# EAGLE board ESP32_Display_2.1(K)_Main_V1.0 (EAGLE 9.6.2)
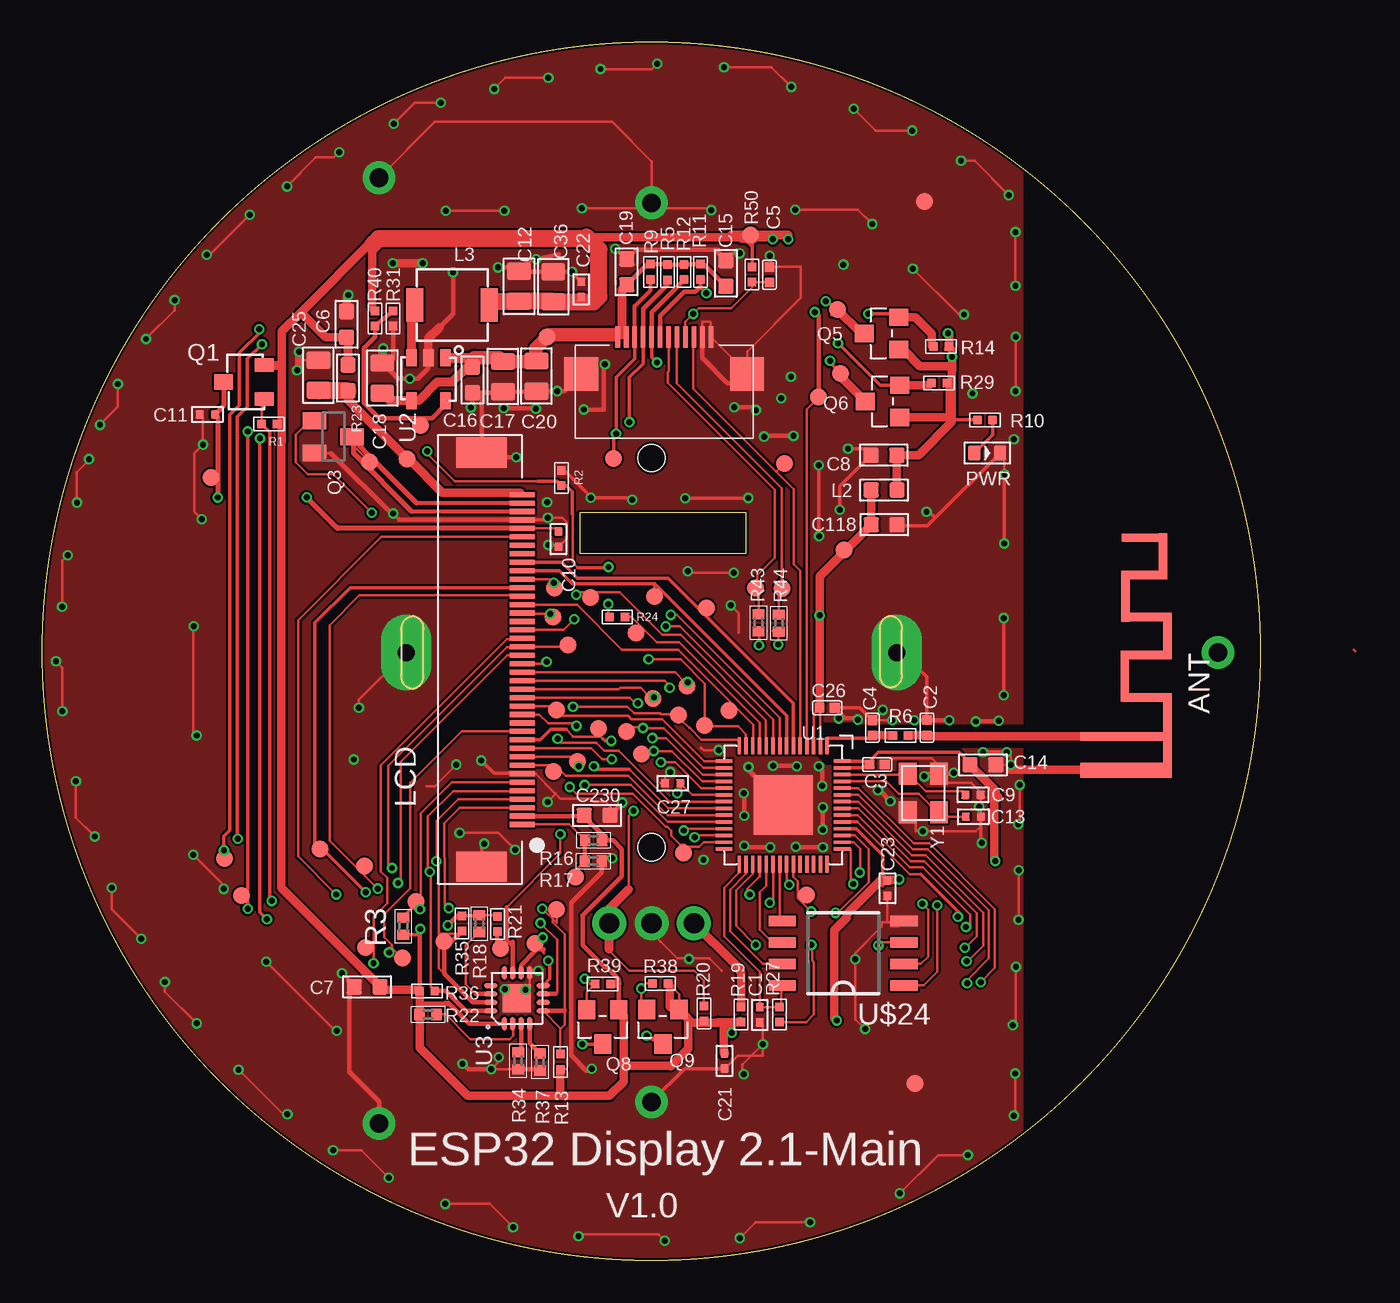
[diagram p6: board, top side]
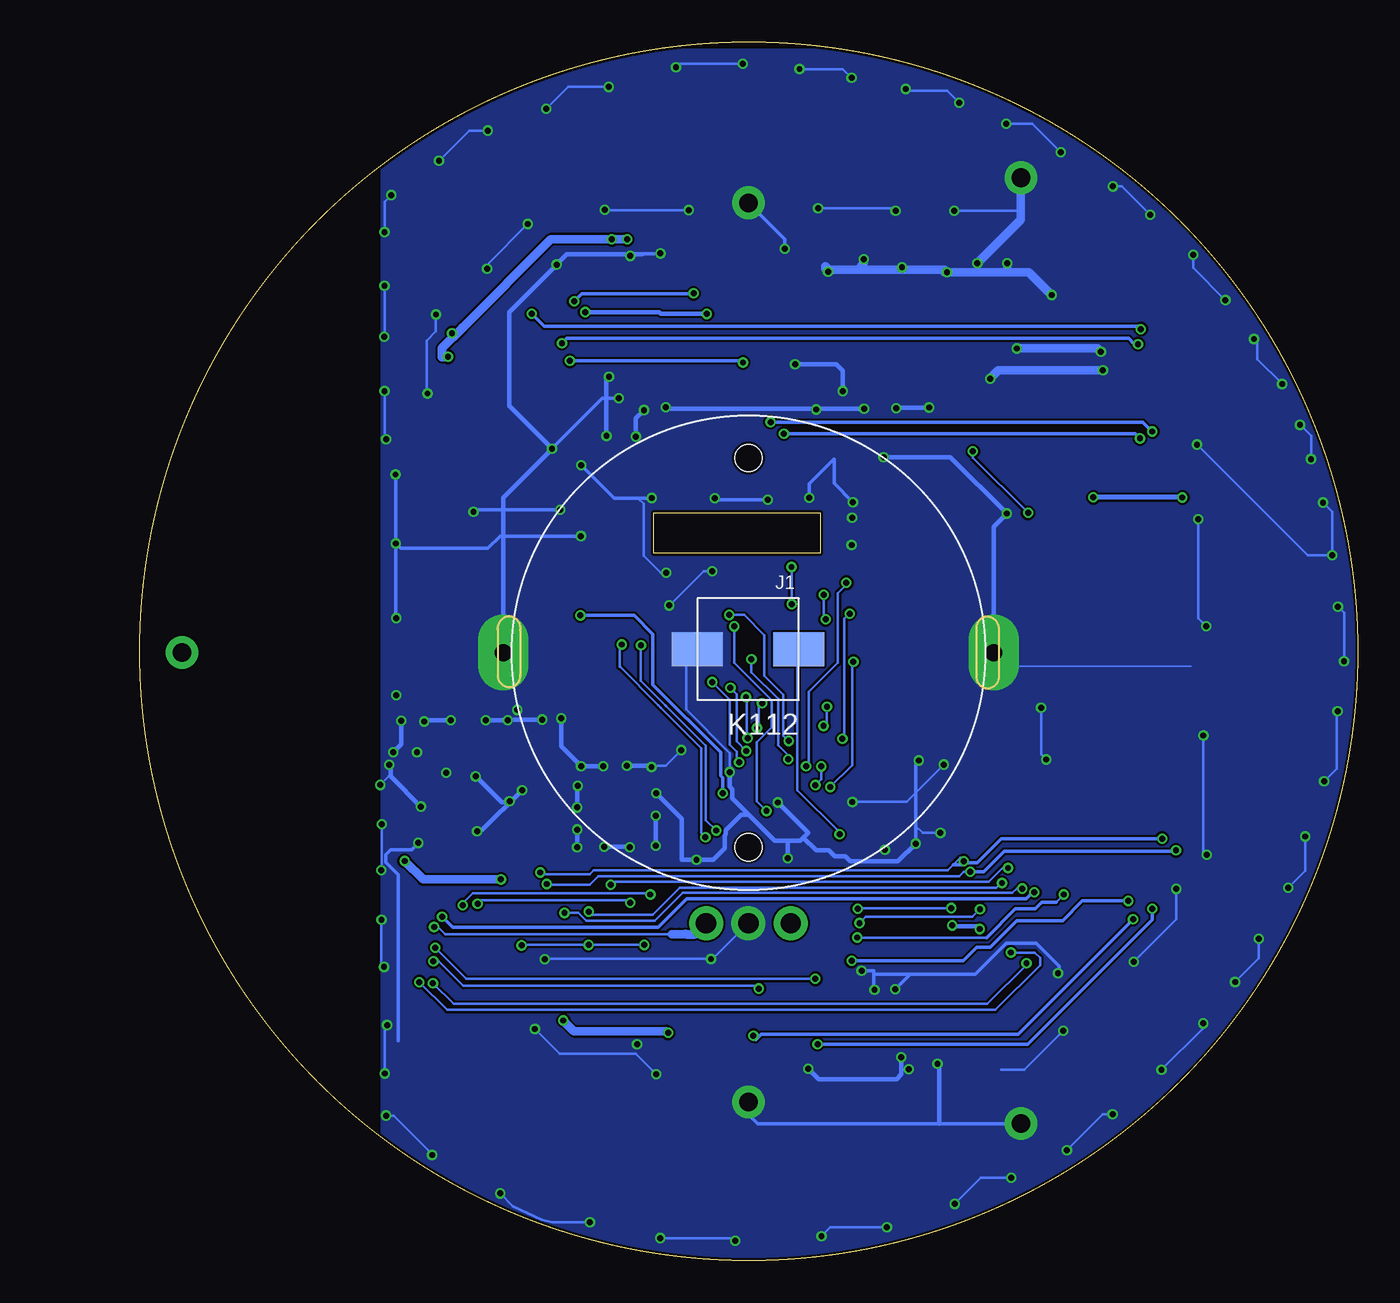
[diagram p7: board, bottom side, seen from below]

Size 72 x 72 mm. Coordinates in mm from the lower left corner, seen from the top.
Outline: 31.78,44.19 31.78,41.79 41.61,41.79 41.61,44.19 31.78,44.19
Outline: circle at 36,36 radius 36
Copper layers (1*16): Top 0.035mm / dielectric 1.5mm / Bottom 0.035mm
Design rules "default *": minimum track width 3mil, minimum drill 0.3mm, track to track 5mil, track to pad 5mil, pad to pad 5mil, via to via 5mil, smd to smd 5mil, copper to edge 6mil, drill to drill 6mil, minimum pad ring 5mil, minimum via ring 5mil, stop-mask expansion 4mil, vias tented up to drill 30mil, thermal gap 5mil
Net classes: 0 default: clearance 0.12 mm; 1 PWR: width 0.254 mm, clearance 0.12 mm to class 0, clearance 0.12 mm

## Footprints (pad centres in the part's own frame; a part is rotated, then mirrored left to right if it is on the bottom)
BT_ANT = smd 0.9 x 5.4: P$1 0,0 | smd 0.5 x 5.4: P$2 -2,0 | smd 5 x 0.5: P$3 -2.053,2.455 | smd 0.5 x 3: P$4 -4.305,1.198; P$6 -6.82,1.195 | smd 3 x 0.5: P$5 -5.57,-0.06; P$9 -10.285,-0.01 | smd 2.7 x 0.5: P$7 -7.93,2.465; P$11 -12.65,2.21 | smd 0.5 x 2.7: P$8 -9.045,1.37; P$10 -11.53,1.095; P$12 -13.74,1.105
0402 = smd 0.5 x 0.5: 1 -0.45,0; 2 0.45,0
C0402 = smd 0.6 x 0.6: 1 -0.45,0; 2 0.45,0
0603 = smd 0.889 x 0.889: 1 -0.762,0; 2 0.762,0
C0603 = smd 0.889 x 0.889: 1 -0.762,0; 2 0.762,0
0805 = smd 1.016 x 1.397: 1 -0.889,0; 2 0.889,0
EC28A-C15H15P3 = drill 1.2 pad 2: 1 -2.5,-16; 2 0,-16; 3 2.5,-16 | drill 1 pad 3 long: 4 -14.5,0; 5 14.5,0 | hole 1.6: 0,-11.5; 0,11.5
0.5MM-12P = smd 0.27 x 1.27: 1 -2.54,3.81; 2 -2.04,3.81; 3 -1.54,3.81; 4 -1.04,3.81; 5 -0.54,3.81; 6 -0.04,3.81; 7 0.46,3.81; 8 0.96,3.81; 9 1.46,3.81; 10 1.96,3.81; 11 2.46,3.81; 12 2.96,3.81 | smd 2 x 2: 13 -4.7,1.61; 14 5.1,1.61
BUTTON_2P = smd 3 x 2: P$1 0,0; P$2 6,0
L0603 = smd 0.889 x 0.889: 1 -0.762,0; 2 0.762,0
L0420 = smd 2 x 1: 1 0,2.2; 2 0,-2.2
0.5MM-40P = smd 1.8 x 3: 41 -2.42,-0.67; 42 22.08,-0.67 | smd 0.3 x 1.5: Y1 0.08,1.73; Y2 0.58,1.73; Y3 1.08,1.73; Y4 1.58,1.73; Y5 2.08,1.73; Y6 2.58,1.73; Y7 3.08,1.73; Y8 3.58,1.73; Y9 4.08,1.73; Y10 4.58,1.73; Y11 5.08,1.73; Y12 5.58,1.73; Y13 6.08,1.73; Y14 6.58,1.73; Y15 7.08,1.73; Y16 7.58,1.73; Y17 8.08,1.73; Y18 8.58,1.73; Y19 9.08,1.73; Y20 9.58,1.73; Y21 10.08,1.73; Y22 10.58,1.73; Y23 11.08,1.73; Y24 11.58,1.73; Y25 12.08,1.73; Y26 12.58,1.73; Y27 13.08,1.73; Y28 13.58,1.73; Y29 14.08,1.73; Y30 14.58,1.73; Y31 15.08,1.73; Y32 15.58,1.73; Y33 16.08,1.73; Y34 16.58,1.73; Y35 17.08,1.73; Y36 17.58,1.73; Y37 18.08,1.73; Y38 18.58,1.73; Y39 19.08,1.73; Y40 19.58,1.73
PAD-1.0MM = smd 1 x 1: P$1 0,0
LED-0603 = smd 0.762 x 0.889: + -0.762,0; - 0.762,0
SOT-23 = smd 1.1 x 0.8: 1 1.2,-1; 2 1.2,1 | smd 1.1 x 0.9: 3 -1.2,0
SPARKFUN_SOT23 = smd 1 x 1.4: 1 -0.95,-1.1; 2 0.95,-1.1; 3 0,1.1
SOT23 = smd 1.016 x 1.143: 1 -0.95,-1.016; 2 0.95,-1.016; 3 0,1.016
0402' = smd 0.5 x 0.5: P$1 -0.45,0; P$2 0.45,0
R0402 = smd 0.6 x 0.7: 1 -0.5,0; 2 0.5,0
DISCRETE_R0603 = smd 0.889 x 0.889: 1 -0.762,0; 2 0.762,0
ESP-S3-QFN56(7×7MM) = smd 1 x 0.2: 1 -3.5,2.6; 2 -3.5,2.2; 3 -3.5,1.8; 4 -3.5,1.4; 5 -3.5,1; 6 -3.5,0.6; 7 -3.5,0.2; 8 -3.5,-0.2; 9 -3.5,-0.6; 10 -3.5,-1; 11 -3.5,-1.4; 12 -3.5,-1.8; 13 -3.5,-2.2; 14 -3.5,-2.6; 29 3.5,-2.6; 30 3.5,-2.2; 31 3.5,-1.8; 32 3.5,-1.4; 33 3.5,-1; 34 3.5,-0.6; 35 3.5,-0.2; 36 3.5,0.2; 37 3.5,0.6; 38 3.5,1; 39 3.5,1.4; 40 3.5,1.8; 41 3.5,2.2; 42 3.5,2.6 | smd 0.2 x 1: 15 -2.6,-3.5; 16 -2.2,-3.5; 17 -1.8,-3.5; 18 -1.4,-3.5; 19 -1,-3.5; 20 -0.6,-3.5; 21 -0.2,-3.5; 22 0.2,-3.5; 23 0.6,-3.5; 24 1,-3.5; 25 1.4,-3.5; 26 1.8,-3.5; 27 2.2,-3.5; 28 2.6,-3.5; 43 2.6,3.5; 44 2.2,3.5; 45 1.8,3.5; 46 1.4,3.5; 47 1,3.5; 48 0.6,3.5; 49 0.2,3.5; 50 -0.2,3.5; 51 -0.6,3.5; 52 -1,3.5; 53 -1.4,3.5; 54 -1.8,3.5; 55 -2.2,3.5; 56 -2.6,3.5 | smd 3.5 x 3.5: 57 0,0
SOT23-5 = smd 1 x 0.635: 1 -1.27,1; 2 -1.27,0; 3 -1.27,-1; 4 1.27,-1; 5 1.27,1
QFN16-3*3 = smd 0.8 x 0.3: 1 -1.5,0.75; 2 -1.5,0.25; 3 -1.5,-0.25; 4 -1.5,-0.75; 9 1.5,-0.75; 10 1.5,-0.25; 11 1.5,0.25; 12 1.5,0.75 | smd 0.3 x 0.8: 5 -0.75,-1.55; 6 -0.25,-1.55; 7 0.25,-1.55; 8 0.75,-1.55; 13 0.75,1.55; 14 0.25,1.55; 15 -0.25,1.55; 16 -0.75,1.55 | smd 1.65 x 1.65: 17 0,0
T-2-1.1 = drill 1.1 pad 1.93: P$1 0,0
FLASHSOP8_SOP8 = smd 0.6 x 1.6: 1 -1.905,-3.6; 2 -0.635,-3.6; 3 0.635,-3.6; 4 1.905,-3.6; 5 1.905,3.6; 6 0.635,3.6; 7 -0.635,3.6; 8 -1.905,3.6
CRYSTAL-3.2-2.5 = smd 1.3 x 1.05: 1 -1.15,-0.925; 2 1.15,-0.925; 3 1.15,0.925; 4 -1.15,0.925

## Placement (x,y rotation side)
ANT  BT_ANT  [BT_ANT]  64.05,28.97 270 top
C1  1UF  [0402]  42.41,14.51 270 top
C2  NC  [C0402]  52.3,31.48 270 top
C3  1uF  [C0402]  49.35,29.3 180 top
C4  NC  [C0402]  49.07,31.47 270 top
C5  1uF  [C0402]  42.99,58.26 270 top
C6  100NF  [0603]  17.99,55.33 90 top
C7  1uF  [C0603]  19.2,16.16 180 top
C8  10NF  [C0603]  49.75,47.59 180 top
C9  12pF  [0402]  55.02,27.51 0 top
C10  1UF  [0402]  30.52,42.63 270 top
C11  100nF  [0402]  9.76,50 180 top
C12  22uF  [0805]  28.18,57.57 270 top
C13  12pF  [0402]  55.04,26.22 0 top
C14  100NF  [C0603]  55.61,29.29 0 top
C15  100NF  [0603]  40.41,58.34 90 top
C16  100NF  [0603]  25.43,52.04 270 top
C17  22uF  [0805]  27.23,52.24 90 top
C18  22uF  [0805]  20.1,52.15 270 top
C19  100NF  [0603]  34.55,58.43 90 top
C20  22uF  [0805]  29.21,52.27 90 top
C21  1UF  [0402]  40.33,11.78 270 top
C22  100nF  [0402]  31.86,57.39 90 top
C23  100nF  [0402]  49.96,21.99 270 top
C25  1uF\30V  [0805]  16.32,52.32 270 top
C26  1uF  [C0402]  46.4,32.66 0 top
C27  0.1uF  [0402]  37.27,28.2 0 top
C36  22uF  [0805]  30.21,57.55 270 top
C118  NC/3PF  [0603]  49.77,43.48 180 top
C230  100nF  [C0603]  32.8,26.3 180 top
J1  EC28A-C15H15P3  [EC28A-C15H15P3]  36.02,35.92 0 bottom
J10  CON_12P_0.5  [0.5MM-12P]  36.56,50.78 0 top
K112  BUTTON_2P  [BUTTON_2P]  33.04,36.12 180 bottom
L2  100M-600R  [L0603]  49.76,45.53 180 top
L3  2.2UH  [L0420]  24.23,56.47 90 top
LCD  LCD-2.1-40P-0.5  [0.5MM-40P]  26.64,45.34 270 top
P1  [PAD-1.0MM]  37.92,24.06 0 top
P2  [PAD-1.0MM]  19.06,23.31 0 top
P3  [PAD-1.0MM]  40.59,32.49 0 top
P4  [PAD-1.0MM]  21.55,47.37 0 top
P5  [PAD-1.0MM]  19.34,47.2 0 top
P6  [PAD-1.0MM]  41.87,60.61 0 top
P7  [PAD-1.0MM]  29.12,18.71 0 top
P8  [PAD-1.0MM]  39.27,38.56 0 top
P9  [PAD-1.0MM]  36.18,39.25 0 top
P10  [PAD-1.0MM]  30.29,39.75 0 top
P11  [PAD-1.0MM]  16.43,24.3 0 top
P12  [PAD-1.0MM]  30.2,38.03 0 top
P13  [PAD-1.0MM]  32.4,39.17 0 top
P14  [PAD-1.0MM]  19.1,18.5 0 top
P15  [PAD-1.0MM]  31.07,36.38 0 top
P16  [PAD-1.0MM]  45.19,21.6 0 top
P17  [PAD-1.0MM]  32.89,31.42 0 top
P18  [PAD-1.0MM]  35.43,29.94 0 top
P19  [PAD-1.0MM]  38.12,33.94 0 top
P20  [PAD-1.0MM]  36.11,33.2 0 top
P21  [PAD-1.0MM]  34.55,31.25 0 top
P22  [PAD-1.0MM]  30.39,32.52 0 top
P23  [PAD-1.0MM]  37.61,32.23 0 top
P24  [PAD-1.0MM]  21.28,17.86 0 top
P25  [PAD-1.0MM]  22.09,21.22 0 top
P26  [PAD-1.0MM]  39.16,31.6 0 top
P27  [PAD-1.0MM]  31.65,29.49 0 top
P28  [PAD-1.0MM]  30.22,28.89 0 top
P29  [PAD-1.0MM]  31.53,22.66 0 top
P30  [PAD-1.0MM]  10.77,23.74 0 top
P31  [PAD-1.0MM]  23.75,18.85 0 top
P32  [PAD-1.0MM]  30.4,20.74 0 top
P33  [PAD-1.0MM]  33.78,47.39 0 top
P34  [PAD-1.0MM]  9.96,46.26 0 top
P35  [PAD-1.0MM]  52.16,62.6 0 top
P36  [PAD-1.0MM]  51.6,10.46 0 top
P37  [PAD-1.0MM]  42.15,39.74 0 top
P38  [PAD-1.0MM]  11.77,21.56 0 top
P39  [PAD-1.0MM]  47.2,52.42 0 top
P40  [PAD-1.0MM]  47,56.2 0 top
P41  [PAD-1.0MM]  27.1,18.43 0 top
P42  [PAD-1.0MM]  43.72,39.7 0 top
P43  [PAD-1.0MM]  45.9,51.02 0 top
P44  [PAD-1.0MM]  43.87,47.11 0 top
P45  [PAD-1.0MM]  47.4,42 0 top
P46  [PAD-1.0MM]  29.83,54.57 0 top
P47  [PAD-1.0MM]  22.37,49.34 0 top
P48  [PAD-1.0MM]  35.1,37.07 0 top
PWR  Green  [LED-0603]  55.86,47.72 0 top
Q1  PMOS-3401-4A  [SOT-23]  11.92,51.92 0 top
Q3  S8050  [SPARKFUN_SOT23]  17.2,48.67 270 top
Q5  BSN20  [SOT23]  49.61,54.79 90 top
Q6  BSN20  [SOT23]  49.67,50.77 90 top
Q8  BSN20  [SOT23]  33.13,13.79 180 top
Q9  BSN20  [SOT23]  36.69,13.8 180 top
R1  10K  [0402']  13.41,49.43 0 top
R2  1K  [0402']  30.68,46.24 270 top
R3  4.7K  [R0402]  21.34,19.75 270 top
R5  10k  [0402']  36.95,58.41 90 top
R6  0R  [0402']  50.73,31.03 180 top
R9  10k  [0402']  35.96,58.43 90 top
R10  1K  [0402']  55.73,49.68 180 top
R11  10k  [0402']  38.92,58.43 90 top
R12  10k  [0402']  37.94,58.42 90 top
R13  10K  [0402']  30.63,11.73 90 top
R14  10K  [0402']  53.14,54.01 180 top
R16  10K  [R0402]  32.59,24.83 0 top
R17  NC  [R0402]  32.57,23.59 0 top
R18  4.7K  [R0402]  25.83,19.9 270 top
R19  10K  [0402']  41.31,14.53 270 top
R20  10K  [0402']  39.11,14.58 270 top
R21  10K  [0402']  26.9,19.88 90 top
R22  4.7K  [R0402]  22.8,14.53 180 top
R23  3.9R 1%  [DISCRETE_R0603]  18.07,52.16 270 top
R24  1K  [0402']  33.99,38.03 180 top
R27  10K  [0402']  43.59,14.52 270 top
R29  10K  [0402']  53.02,51.85 180 top
R31  24K  [0402']  20.74,55.67 90 top
R34  4.7K  [R0402]  28.13,11.79 270 top
R35  10k  [0402']  24.82,19.9 90 top
R36  10k  [0402']  22.75,15.92 0 top
R37  4.7K  [R0402]  29.42,11.72 270 top
R38  10k  [0402']  36.53,16.37 0 top
R39  10k  [0402']  33.13,16.33 180 top
R40  110K  [0402']  19.68,55.67 90 top
R43  10R  [R0402]  42.34,37.69 270 top
R44  10R  [R0402]  43.54,37.65 270 top
R50  10K  [0402']  41.96,58.27 270 top
U1  ESP-S3-QFN56(7×7MM)  [ESP-S3-QFN56(7×7MM)]  43.8,26.91 270 top
U2  RY3420  [SOT23-5]  22.83,52.09 270 top
U3  PCF8574RGT  [QFN16-3*3]  28.06,15.49 90 top
U$9  T-2-1.1  [T-2-1.1]  36.01,9.36 0 top
U$19  T-2-1.1  [T-2-1.1]  36.02,62.51 0 top
U$24  FLASHSOP8_W25X20CL  [FLASHSOP8_SOP8]  47.34,18.15 90 top
U$29  T-2-1.1  [T-2-1.1]  19.91,63.99 0 bottom
U$30  T-2-1.1  [T-2-1.1]  69.51,35.93 0 top
U$32  T-2-1.1  [T-2-1.1]  19.91,8.08 0 top
Y1  3225_40M  [CRYSTAL-3.2-2.5]  52.08,27.62 270 top

## Tracks (layer width: path | path; a pad name or v marks a point on that pad's centre or on a via)
3.3V  (via drill 0.35)
  Top 0.15: U1.20 38.41,27.51 C27.2 | C118.2 48.88,43.48 P45.P$1 47.21,41.81 45.95,40.55 v45.95,38.12 | U1.3 45.6,32.31 C26.1 46,32.61 U1.2
  Top 0.2: C27.2 37.72,27.76 37.54,27.58 v37.54,27.61
  Top 0.5: L2.2 C118.2 47.34,41.81 | 47.34,41.81 47.21,41.81 | C26.1 45.95,33.56 45.95,33.95 v45.95,38.12 45.95,40.42 47.34,41.81
  Bottom 0.2: v37.54,27.61 37.54,28.53 37.65,28.64 37.65,30.02 41.66,34.03 41.66,37.01 42.77,38.12 v45.95,38.12
11
  cutout Top: 58.52,65.15 73.05,61.17 69.08,65.14 58.53,65.14
33
  cutout Top: 45.93,31.6 46.18,31.35 46.18,30.34 59.45,30.34 59.45,31.62 45.93,31.62 45.93,30.41
555
  cutout Top: 45.82,31.65 45.81,31.64 45.81,29.82 46.31,29.32 46.32,29.31 48.13,29.31 48.13,31.56 47.96,31.73 45.95,31.73 45.82,31.6
8888
  cutout Top: 58.02,64.72 58.02,7.52 59.04,6.5 72.13,19.59 72.13,55.22 62.88,64.47 58.08,64.47 58.05,64.44 58.05,64.38
B1  (via drill 0.35)
  Top 0.15: U1.10 42.78,30.43 42.78,31.92 37.73,36.97 36.65,36.97 34.14,39.48 32.43,39.48 31.81,39.48 31.71,39.48 v31.57,39.34 | v31.45,37.89 30.82,37.26 LCD.Y17
  Top 0.152: 32.43,39.48 32.4,39.45 P13.P$1 32.09,39.48 31.81,39.48
  Bottom 0.15: v31.57,39.34 31.57,38.01 v31.45,37.89
B2  (via drill 0.35)
  Top 0.15: U1.51 48.25,27.51 51.46,24.3 52.35,24.3 55.96,20.69 55.96,17.84 54.67,16.55 v54.67,16.38 | v19.58,17.56 19.58,18.74 | 19.58,18.74 19.58,20.31 20.38,21.11 20.38,22.61 20.01,22.98 20.01,29.25 27.46,36.7 28.31,36.7 LCD.Y18 | P14.P$1 19.34,18.5 19.58,18.74
  Top 0.152: 19.16,18.44 P14.P$1 | U1.51 47.58,27.51
  Bottom 0.15: v54.67,16.38 53.44,15.15 21.89,15.15 19.54,17.5 19.54,17.52 v19.58,17.56
B3  (via drill 0.35)
  Top 0.15: U1.36 44,22.3 44.1,22.2 v44.16,22.2 | v20.68,23.19 20.46,23.41 20.46,29.24 27.47,36.25 LCD.Y19 30.95,36.26 P15.P$1
  Top 0.152: 31.34,36.38 P15.P$1
  Bottom 0.15: v44.16,22.2 43.99,22.37 21.82,22.37 20.84,23.35 v20.68,23.19
B4  (via drill 0.35)
  Top 0.15: U1.37 44.4,22.67 44.66,22.41 44.66,21.41 44.73,21.34 | 44.73,21.34 v45.46,20.61 | v21.03,22.3 v21.03,22.29 21.2,22.12 21.2,29.47 27.49,35.76 LCD.Y20 | P16.P$1 44.93,21.34 44.73,21.34
  Top 0.152: 45.36,21.77 P16.P$1
  Bottom 0.15: v45.46,20.61 45.28,20.43 41.67,20.43 40.07,22.03 21.37,22.03 21.11,22.3 21.07,22.26 v21.03,22.3
B5  (via drill 0.35)
  Top 0.15: 37.95,24.56 37.98,24.56 38.1,24.44 38.83,24.44 39.1,24.71 U1.27 | 37.95,24.56 37.71,24.56 37.19,25.08 37.19,25.39 36.95,25.63 36.86,25.63 34.91,27.58 31.58,27.58 v31.18,27.98 | v29.81,35.38 29.69,35.26 LCD.Y21 | P1.P$1 37.92,24.53 37.95,24.56
  Top 0.152: P1.P$1 37.92,24.39
  Bottom 0.15: v31.18,27.98 29.88,29.28 29.88,35.31 v29.81,35.38
BL_PWM
  Top 0.15: U1.11 42.4,31.76 37.64,36.52 36.33,36.52 35.49,37.36 | R24.P$1 34.82,38.03 35.49,37.36 | P48.P$1 35.39,37.36 35.49,37.36
DE  (via drill 0.35)
  Top 0.15: U1.45 48.02,25.11 48.84,24.29 48.84,22.35 46.96,20.47 46.95,20.47 v46.89,20.53 | LCD.Y13 28.33,39.3 18.74,39.3 16.99,37.55 16.99,24.81 v19.83,21.97 19.06,22.74 P2.P$1
  Bottom 0.15: v46.89,20.53 46.09,20.53 45.62,20.06 41.54,20.06 39.89,21.71 20.41,21.71 20.15,21.97 v19.83,21.97
ENCODER_SW  (via drill 0.35)
  Top 0.15: 27.81,18.86 U3.11 27.81,18.53 27.59,18.75 | 27.45,20.87 30.63,24.05 v30.63,25.18 | 27.8,18.84 27.51,18.84 P41.P$1
  Top 0.254: 27.45,20.87 27.45,18.78 P41.P$1 26.9,18.63 R21.P$1 | 27.8,18.84 U3.11
  Bottom 0.15: K112.P$1 33.12,36.04 33.12,27.79 30.63,25.3 v30.63,25.18
ESP_RXD  (via drill 0.35)
  Top 0.15: Q9.2 35.4,15.16 v35.4,16.06 35.71,16.37 R38.P$1 | U1.50 48.24,27.11 51.41,23.94 52.23,23.94 55.62,20.55 55.62,18.59 54.7,17.67 v54.64,17.67
  Bottom 0.15: v54.64,17.67 54.32,17.67 52.87,16.22 35.56,16.22 v35.4,16.06
ESP_TXD  (via drill 0.35)
  Top 0.15: Q8.2 32.18,15.83 R39.P$2 32.37,16.33 v32.06,16.64 | U1.49 48.22,26.71 51.34,23.6 52.14,23.6 55.24,20.5 55.24,19.17 54.55,18.48 v54.53,18.48
  Top 0.152: U1.49 47.33,26.71
  Bottom 0.15: v54.53,18.48 52.69,16.64 v32.06,16.64
G0  (via drill 0.35)
  Top 0.12: 28.39,34.78 LCD.Y22
  Top 0.15: U1.19 38.95,27.91 37.42,29.44 v36.57,29.44 | LCD.Y22 37.41,34.76 37.99,34.18 v38.16,34.18 38.16,33.98 P19.P$1
  Bottom 0.15: v38.16,34.18 37.11,33.13 37.11,30.46 36.72,30.07 36.72,29.59 v36.57,29.44
G1  (via drill 0.35)
  Top 0.12: LCD.Y23
  Top 0.15: U1.18 39,28.31 37.21,30.1 v36.14,30.1 35.59,30.1 P18.P$1 | LCD.Y23 36.79,34.25 37.08,33.96 v37.08,33.84 37.13,33.84
  Top 0.152: P18.P$1
  Top 0.154: 35.7,29.94 P18.P$1
  Bottom 0.15: v36.14,30.1 36.71,30.67 36.71,33.47 v37.08,33.84
G2  (via drill 0.35)
  Top 0.15: U1.17 39.04,28.71 36.88,30.87 v36.07,30.87 | v36.16,33.29 35.92,33.29 35.38,33.83 34.17,33.83 34.08,33.74 34.06,33.76 LCD.Y24
  Top 0.5: v36.16,33.29 36.11,33.24 P20.P$1
  Bottom 0.15: v36.16,33.29 36.11,33.24 36.11,30.91 v36.07,30.87
G3  (via drill 0.35)
  Top 0.15: U1.16 39.08,29.11 36.73,31.46 v35.51,31.46 35.48,31.49 34.79,31.49 P21.P$1 | v35.21,32.93 35.14,32.86 34.74,33.26 LCD.Y25
  Top 0.154: P21.P$1 34.55,31.22
  Bottom 0.15: v35.21,32.93 35.25,32.89 35.42,32.89 35.42,31.55 v35.51,31.46
G4
  Top 0.12: LCD.Y26
  Top 0.15: U1.15 39.13,29.51 36.65,31.99 34.82,31.99 34.63,32.18 30.64,32.18 30.06,32.76 | LCD.Y26 29.68,32.76 30.06,32.76 | 30.06,32.76 30.15,32.76 P22.P$1
  Top 0.152: 39.89,29.51 U1.15
G5  (via drill 0.35)
  Top 0.15: 37.61,32.11 37.81,31.9 | 37.81,31.99 37.81,31.9 | U1.14 41.2,30.64 41.06,30.78 38.96,30.78 38.27,31.47 38.24,31.47 37.81,31.9 | LCD.Y27 29.39,32.26 29.92,31.73 31.44,31.73 v31.58,31.59 | v31.38,32.73 34.58,32.73 34.98,32.33 36.52,32.33 36.57,32.28 37.05,32.28 37.27,32.06 37.33,32.06 37.45,31.95 37.61,32.11 | P23.P$1 37.61,32.11
  Top 0.154: 37.86,31.98 P23.P$1
  Bottom 0.15: v31.38,32.73 31.38,31.73 31.55,31.55 v31.58,31.59
GND  (via drill 0.35)
  Top 0.076: C14.2 v57.25,29.29 v57.26,29.29 | 64.02,29 ANT.P$1
  Top 0.15: 55.47,26.94 C9.2 55.47,27.68 54.92,28.23 53.55,28.23 53.06,28.71 | 55.47,26.91 55.47,26.24 C13.2 55.49,25.66 55.19,25.36 v52.06,25.36 51.62,25.36 51.62,26 Y1.2 | 61.86,28.97 ANT.P$1 | Y1.4 53.06,28.71 | v50.24,31.93 C4.1 v49.68,32.53 | v37.12,28.86 36.82,28.56 C27.1 | 17.06,47.72 Q3.2 | 21.09,43.82 v20.76,44.15 | v48.06,17.8 48.06,18.16 49.63,19.73 49.63,19.98 49.96,19.98 | 50.2,19.73 50.62,19.73 U$24.4 50.87,19.98 49.96,19.98 | C23.2 49.96,19.98 | 36.03,19.37 36.53,18.87 37.55,17.85 39.43,17.85 40.16,17.12 | 25.99,11.29 v26.53,11.29 | v26.54,11.29 R34.2 | U3.9 28.81,16.24 v28.57,16 28.51,15.94 U3.17 | C21.2 41.1,12.1 42.6,12.1 42.6,12.73 | LCD.Y34 29.16,28.76 30.25,27.68 | C230.1 33.56,26.85 33.31,27.1 32.6,27.1 32.41,27.29 30.63,27.29 30.36,27.57 | U$29.P$1 23.21,67.29 33.68,67.29 36.02,64.95 U$19.P$1 | C3.1 50.18,29.68 52.59,29.68 53.06,29.21 53.06,28.71
  Top 0.152: C9.2 55.47,27.29 | 36.55,28.2 C27.1 | 36.53,18.87 36.02,19.38 J1.2 | C25.1 15.24,53.21 15.18,53.15 | v57.01,30.03 57.26,29.78 v57.26,29.29 57.26,29 | C1.2 42.6,13.87 v42.6,12.77 | 42.6,12.73 v42.6,12.77 | v42.6,12.77 41.39,11.56 41.39,11 v41.47,11 | v48.64,13.67 48.06,14.25 v48.06,17.8 | 43.01,58.73 44.85,58.73 44.85,56.9 41.66,53.71 41.66,52.5 | v26.54,11.29 26.98,11.73 v26.98,12 | 40.51,51.84 41.02,51.84 | 41.66,52.5 41.61,52.5 J10.12 39.52,55.46 39.49,55.49 39.04,55.49 39.02,55.47 J10.11 | J10.14 41.66,52.5 | PWR.- 56.86,47.48 56.86,46.43 | v57.79,28.1 57.79,25.86 v57.7,25.77 | v57.73,23.06 57.73,20.15 v57.71,20.13 | v57.56,17.34 57.56,14.08 v57.38,13.9 | v57.52,11.04 57.52,8.63 v57.44,8.55 | v54.72,6.22 52.96,6.22 v50.69,3.95 | v45.39,2.25 42.17,2.25 v41.23,1.31 | v36.8,1.15 36.42,1.53 31.76,1.53 31.7,1.47 v31.7,1.42 | v27.83,1.95 26.45,3.33 v23.82,3.33 | v20.48,4.88 18.86,6.5 v17.19,6.5 | v14.49,8.63 14.23,8.63 v11.6,11.26 | v9.13,14 7.25,15.88 v7.25,16.45 | v5.85,19 4.1,20.75 v4.1,22.02 | v3.1,25.05 1.99,26.16 v1.99,28.32 | v1.19,32.46 1.19,35.03 v0.81,35.41 | v1.17,38.63 1.17,41.35 v1.5,41.68 | v2.05,44.79 2.05,46.59 2.76,47.3 v2.76,47.36 | v3.41,49.38 4.47,50.44 v4.47,51.8 | v6.13,54.46 7.82,56.15 v7.82,56.76 | v9.73,59.44 9.9,59.44 v12.26,61.8 | v14.47,63.48 16.18,65.19 17.24,65.19 v17.55,65.5 | v20.77,67.18 22.02,68.43 v23.56,68.43 | v26.71,69.24 27.38,69.91 v29.92,69.91 | v33,70.42 36.04,70.42 v36.35,70.73 | v40.3,70.53 43.1,70.53 v44.27,69.36 | v47.97,68.07 49.26,66.78 v51.43,66.78 | v54.31,64.99 55.11,64.99 v57.13,62.97 | v57.53,60.78 v57.53,57.6 | v57.55,54.59 57.55,51.4 v57.53,51.38 | v23.85,62.04 v27.32,62.04
  Top 0.152: v31.9,62.19 39.37,62.19 39.51,62.05 v39.54,62.08 | v44.52,62.1 48.22,62.1 v49.06,61.26 | v51.47,58.61 54.17,55.91 v54.49,55.91 | v9.43,43.81 8.98,44.26 8.98,47.7 v9.5,48.22 9.5,49.81 C11.2 | v8.96,37.48 8.93,37.45 8.93,31.08 8.99,31.02 v9.12,31.02 | v8.93,23.97 10.72,22.18 v10.72,21.95 | v13.24,17.64 17.31,13.57 v17.4,13.57 | v40.88,40.64 38.24,40.64 v38.15,40.73 | v40.7,38.71 41.16,38.25 41.16,37.09 | v39.99,30.16 39.09,30.16 38.94,30.31 | J1.5 18.72,33.12 v18.72,32.66 | 30.25,27.68 30.36,27.57 30.35,27.57 v29.87,27.09 | v24.48,29.3 23.21,28.03 22.72,28.03 | v24.67,25.26 26.96,25.26 v27.95,24.27 | v29.92,42.28 30.42,42.28 C10.2 30.99,42.65 30.99,43.64 30.73,43.9 v29.89,43.9
  Top 0.154: PWR.- 56.62,47.53
  Top 0.2: C26.2 48.33,32.66 C4.1 | U$9.P$1 37.98,11.33 C21.2 | U3.9 28.94,17.12 v29.33,17.12 | v17.72,16.96 18.44,16.24 C7.2 | v27.34,16.02 28.42,16.02 28.51,15.94 | PWR.- 52.78,43.88 | 52.78,43.88 52.31,43.41 50.6,43.41 C118.1 | C22.2 31.38,58.32 31.38,58.37 v31.31,58.44 C36.1 | C2.1 52.3,34.48 50.86,35.92 J1.4 | LCD.42 25.97,24.47 v26.13,24.63 | v25.95,29.54 26.71,28.78 28.35,28.78 LCD.Y34 | C15.2 40.83,59.52 v41.22,59.52 | v43.01,59.37 43.01,58.73 C5.1 | 35.24,59.74 35.1,59.74 C19.2 34.48,59.19 v33.87,59.8 | v47.63,47.97 48.61,47.97 C8.2 47.15,45.75 v47.15,44.36 | v52.27,44.25 52.41,44.25 52.78,43.88 | LCD.Y4 29.75,43.76 v29.89,43.9 | 29.92,44.73 v29.84,44.81 | v32.42,45.08 32.48,45.08 | 32.48,45.08 34.75,45.08 v34.87,44.96 | v38.01,45.04 41.71,45.04 v41.73,45.06 | v45.9,47 45.9,42.83 v45.92,42.81 | v56.86,42.37 56.86,46.43 v56.88,46.45 | v56.83,37.96 v56.83,33.4 | C13.2 55.49,24.71 v55.53,24.67 | R2.P$1 30.87,46.69 32.48,45.08
  Top 0.254: 30.53,59.48 v29.2,59.17 28.79,59.07 C12.1 28.09,58.55 28.48,58.55 | C36.1 | 30.51,58.14 C36.1 | 26.09,51.28 C16.2 25.43,50.5 v25.34,50.41 | 26.09,51.28 27.16,51.28 C17.1 29.18,51.35 C20.1 v30.44,51.38 30.85,51.38 J10.13 | C18.1 20.29,52.85 | 20.29,52.85 21.03,52.11 v21.72,52.11 22.21,52.11 22.83,52.73 U2.2 | C15.2 39.95,59.56 39.95,59.74 35.24,59.74 | C36.1 28.37,58.44 28.48,58.55 | R31.P$1 20.74,53.3 20.29,52.85 | v24.28,58.41 24.28,55.94 23.48,55.15 | v26.94,58.69 28.36,58.69 28.49,58.56 28.48,58.55 | 26.09,51.28 25.97,51.16 LCD.41 26.26,47.47 v28.03,47.47 | J10.11 39.02,53.36 39,53.34 40.51,51.84 41.11,51.84 | J10.12 39.52,54.53 | LCD.Y4 21.14,43.76 21.09,43.82 | v20.76,44.15 20.64,44.15 17.06,47.72 | R34.2 29.35,11.29 R37.2 | v26.53,11.29 v26.54,11.29 25.17,11.29 v24.84,11.62 | v32.48,11.32 32.48,11.2 32.17,11.2 31.26,12.11 31.26,14.93 31.26,21.12 33.07,22.93 R17.2 33.23,23.75 v33.69,23.75 v33.7,23.76 | C7.2 18.16,15.88 18.16,11.13 19.91,9.38 U$32.P$1 | C230.1 34.28,27.02 v34.28,27.06 | U1.57 41.75,28.96 v41.75,29.16 | v43.2,29.23 44.57,29.23 v44.6,29.2 | v45.91,29.2 46.11,29 v46.11,28.04 | v46.15,26.77 v46.15,25.47 v46.14,25.46 | v46.15,24.41 44.57,24.41 v44.54,24.44 | v43.03,24.42 41.58,24.42 v41.5,24.5 | v41.5,26.28 41.5,27.56 v41.46,27.6 | v52.15,28.6 52.32,28.77 Y1.4 53.83,28.77 v53.88,28.82 | v50.14,27.14 49.5,27.78 v49.4,27.78 | 55.47,26.94 55.47,26.9 | 55.47,26.91 v55.38,26.82 | v51.54,31.93 C2.1 v53.6,31.93 v53.61,31.92 | C26.2 47.48,32.03 | 47.48,32.03 v47.08,32.03 | v48.21,31.96 48.14,32.03 47.48,32.03 | v55.19,31.85 56.5,31.85 v56.54,31.89 | v57.01,30.03 v55.61,30.03 | v27.28,50.37 29.15,50.37 v29.18,50.34
  Top 0.254: v32.01,50.29 33.2,50.29 33.2,52.97 v33.26,52.97 | v40.9,50.42 42.03,50.42 v42.19,50.26 | v42.67,48.69 42.71,48.73 v44.41,48.73
  Top 0.3: C9.2 55.61,27.37
  Top 0.5: 57.26,29 64.02,29 | C18.1 20.1,53.85 v20.15,53.9 | v15.18,53.71 15.18,53.15 15.18,52.75 15.06,52.63 v15.06,52.61 | U2.2 22.83,54.49 23.48,55.15 | C6.2 17.99,56.96 v18.09,57.06 | v20.72,58.93 v22.48,58.93
  Bottom 0.076: J1.5 20.7,35.1 9.84,35.1
  Bottom 0.15: v37.12,28.86 37.12,29.98 39.7,32.56 39.7,35.46 K112.P$2 | v38.23,17.81 v48.05,17.81 v48.06,17.8
  Bottom 0.152: v38.23,17.81 38.13,17.81 J1.2 | v41.47,11 42.67,12.2 47.17,12.2 v48.64,13.67 | 57.16,28.6 57.29,28.6 v57.79,28.1 | v57.7,25.77 57.7,23.09 v57.73,23.06 | v57.71,20.13 57.71,17.44 57.59,17.32 57.58,17.32 v57.56,17.34 | v57.38,13.9 57.52,13.76 v57.52,11.04 | v57.44,8.55 56.99,8.55 54.69,6.25 v54.72,6.22 | v50.69,3.95 49.94,3.2 48.23,2.41 47.61,2.24 v45.39,2.24 v45.39,2.25 | v41.23,1.31 36.96,1.31 v36.8,1.15 | v31.7,1.42 31.17,1.95 v27.83,1.95 | v23.82,3.33 22.27,4.88 v20.48,4.88 | v17.19,6.5 15.06,8.63 v14.49,8.63 | v11.6,11.26 9.2,13.66 9.2,14 v9.13,14 | v7.25,16.45 5.85,17.85 v5.85,19 | v4.1,22.02 3.1,23.02 v3.1,25.05 | v1.99,28.32 1.25,29.06 1.25,32.4 v1.19,32.46 | v0.81,35.41 0.81,38.27 v1.17,38.63 | v2.05,44.79 1.5,44.24 v1.5,41.68 2.96,41.68 v9.5,48.22 | v2.76,47.36 2.76,48.73 v3.41,49.38 | v4.47,51.8 5.94,53.27 5.94,54.27 v6.13,54.46 | v7.82,56.76 9.73,58.67 v9.73,59.44 | v12.26,61.8 13.96,63.5 14.47,63.5 v14.47,63.48 | v17.55,65.5 19.23,67.18 v20.77,67.18 | v23.56,68.43 24.27,69.14 26.61,69.14 v26.71,69.24 | v29.92,69.91 30.43,70.42 v33,70.42 | v36.35,70.73 40.1,70.73 v40.3,70.53 | v44.27,69.36 46.68,69.36 v47.97,68.07 | v51.43,66.78 52.52,66.78 v54.31,64.99 | v57.13,62.97 57.53,62.57 v57.53,60.78 | v57.53,57.6 57.53,54.61 v57.55,54.59 | v57.53,51.38 57.53,48.63 v57.44,48.54 | 19.91,61.89 20.06,62.04 v23.85,62.04 | v27.32,62.04 27.47,62.19 v31.9,62.19 | v39.54,62.08 44.5,62.08 v44.52,62.1 | v49.06,61.26 51.47,58.85 v51.47,58.61 | v54.49,55.91 54.49,54.91 55.04,54.36 55.04,51.32 54.99,51.27 v54.99,51.24 | 47.31,58.91 v47.36,58.86 | v9.43,43.81 9.43,37.95 v8.96,37.48 | v9.12,31.02 9.12,24.16 v8.93,23.97
  Bottom 0.152: v10.72,21.95 10.72,20.16 v13.24,17.64 | v17.4,13.57 19.7,11.27 21.08,11.27 | 42.56,45.06 42.21,44.71 42.21,41.64 41.21,40.64 v40.88,40.64 | v38.15,40.73 38.66,40.73 40.68,38.71 v40.7,38.71 | 42.39,29.23 40.92,29.23 v39.99,30.16 | 39.22,23.67 v39.09,23.67 | v18.72,32.66 18.72,29.91 v18.41,29.6 | v29.87,27.09 26.67,27.09 v24.47,29.29 v24.48,29.3 | 26.13,25.67 25.72,25.26 v24.67,25.26
  Bottom 0.2: v29.33,17.12 28.6,17.12 28.6,16.9 | 28.6,16.9 26.46,16.9 | 26.46,16.9 22.61,16.9 20.78,18.73 19,18.73 17.64,17.37 17.64,16.96 v17.72,16.96 | 26.46,16.9 v27.34,16.02 | 28.6,16.9 28.6,15.96 v28.57,16 | U$32.P$1 24.73,8.08 35.48,8.08 36.01,8.61 U$9.P$1 | v26.13,24.63 26.13,25.67 26.13,29.36 v25.95,29.54 | v41.22,59.52 v41.23,59.51 42.25,59.51 42.29,59.47 42.91,59.47 v43.01,59.37 | v33.87,59.8 33.87,60.36 U$19.P$1 | v43.69,50.96 44.66,50.96 v47.64,47.98 v47.63,47.97 | v47.15,44.36 52.16,44.36 v52.27,44.25 | v29.89,43.9 30.08,43.9 | v29.84,44.81 30.95,45.92 30.95,47.35 30.97,47.35 32.42,45.9 v32.42,45.08 | v34.87,44.96 37.93,44.96 v38.01,45.04 | v41.73,45.06 42.56,45.06 43.96,45.06 v45.9,47 | v45.92,42.81 50.7,42.81 51.43,42.08 56.57,42.08 v56.86,42.37 | v56.88,46.45 56.88,38.01 v56.83,37.96 | v55.53,24.67 55.92,24.28 57.15,24.28 57.46,23.97 57.46,23.53 56.72,22.79 56.72,12.98
  Bottom 0.254: 42.29,59.47 46.75,59.47 47.31,58.91 | v47.36,58.86 50.17,56.05 50.17,50.51 v47.63,47.97 50.52,45.08 J1.4 | J1.5 21.52,43.35 v20.74,44.13 v20.76,44.15 24.08,47.47 v28.03,47.47 | v24.84,11.62 24.73,11.51 24.73,8.08 | v32.48,11.32 31.87,10.71 27.26,10.71 26.98,10.99 v26.98,12 | v34.28,27.06 32.48,25.27 32.77,24.99 | 32.77,24.99 32.01,24.23 31.27,24.23 30.91,23.87 30.28,23.87 29.99,23.58 27.18,23.58 v26.13,24.63 | v37.12,28.86 37.12,27.98 36.98,27.84 36.98,27.32 36,26.34 | 36,26.34 34.46,24.8 33.73,24.8 | 33.73,24.8 32.95,24.8 32.77,24.99 | v33.7,23.76 33.7,24.77 33.73,24.8 | v41.75,29.16 41.82,29.23 42.39,29.23 v43.2,29.23 | v44.6,29.2 v45.91,29.2 47.08,30.37 v47.08,32.03 | v46.11,28.04 46.15,28 v46.15,26.77 | v46.14,25.46 v46.15,25.45 v46.15,24.41 | v44.54,24.44 43.07,24.44 v43.04,24.41 v43.03,24.42 | v41.5,24.5 v41.5,26.28 | v41.46,27.6 39.96,26.1 39.96,23.67 39.22,23.67 | v39.09,23.67 38.1,23.67 37.41,24.36 37.41,25.13 37.36,25.18 37.36,25.41 36.43,26.34 36,26.34 | v52.15,28.6 50.61,27.06 50.14,27.06 v50.14,27.14 | v49.4,27.78 51.8,25.38 52.06,25.38 v52.06,25.36 | v55.38,26.82 57.16,28.6 57.16,29.04 57.25,29.13 v57.25,29.29 | v48.21,31.96 50.23,31.96 50.24,31.95 v50.24,31.93 v51.53,31.93 v51.54,31.92 v51.54,31.93 | v53.61,31.92 55.12,31.92 v55.19,31.85 | v56.54,31.89 56.54,30.5 v57.01,30.03 | v25.34,50.41 27.24,50.41 v27.28,50.37 | v29.18,50.34 31.96,50.34 | 31.96,50.34 v32.01,50.29 | v33.26,52.97 30.84,52.97 30.44,52.57 v30.44,51.38 | 31.96,50.34 40.82,50.34 v40.9,50.42 | v42.19,50.26 42.67,49.78 v42.67,48.69 | v44.41,48.73 44.41,52.08 v44.26,52.23
  Bottom 0.5: v20.15,53.9 15.37,53.9 v15.18,53.71 | v15.06,52.61 21.25,52.61 21.72,52.14 v21.72,52.11 | v18.09,57.06 19.44,58.41 20.87,58.41 | 20.87,58.41 v24.28,58.41 | v24.28,58.41 24.43,58.41 | v24.28,58.41 24.42,58.55 26.94,58.55 | 26.94,58.55 v26.94,58.69 | 20.87,58.41 20.72,58.56 v20.72,58.93 | v22.48,58.93 19.91,61.5 19.91,61.89 U$29.P$1 | 26.94,58.55 29.57,58.55 | 29.57,58.55 31.26,58.55 31.48,58.77 31.48,58.61 v31.31,58.44 | 29.57,58.55 29.2,58.93 v29.2,59.17
  pour Top (no thermals): 13.56,66.03 -0.92,51.55 -0.92,44.48 -0.92,21.35 0.13,20.3 0.13,18.27 15.66,2.74 19.66,-1.26 34.24,-1.26 53.95,-1.26 56.06,0.85 72.64,17.43 72.64,25.13 72.64,47.31 72.43,47.52 72.43,51.87 57.01,67.29 51.12,73.18 38.64,73.18 25.32,73.18 24.37,72.23 21.24,69.1 19.36,69.1 16.34,66.08 13.58,66.08 13.6,66.1 13.6,66.18
  pour Bottom (no thermals): -0.69,52.17 -0.69,18.88 -0.52,18.71 13.93,4.26 16.1,4.26 20.39,-0.03 24.49,-0.03 25.19,-0.73 40.41,-0.73 52.83,-0.73 57.73,4.17 57.73,64.6 57.91,64.78 54.06,68.63 53.45,68.63 50.47,71.61 26.07,71.61 24.93,70.47 16.8,70.47 11.72,65.39 9.62,63.29 8.83,63.29
GPIO0
  Top 0.15: U1.5 44.8,40.75 44.42,41.13 44.42,45.59 43.36,46.66 | 43.36,46.66 38.49,51.52 38.49,54.56 J10.10 | P44.P$1 43.41,46.66 43.36,46.66
GPIO4  (via drill 0.35)
  Top 0.15: R20.P$1 39.11,16.53 38.53,17.11 34.7,17.11 33.49,18.32 33.49,18.39 33.49,20.74 | U1.9 43.2,31.95 37.68,37.47 v36.86,37.47 | v34.95,26.56 34.68,26.29 34.68,21.93
  Top 0.152: J1.3 33.49,19.89
  Top 0.5: 34.68,21.93 33.49,20.74
  Top 0.524: 33.49,19.89 33.49,18.39
  Bottom 0.15: v36.86,37.47 36.86,35.31 34.65,33.1 34.65,31.5 35.52,30.63 35.52,27.13 v34.95,26.56
GPIO38-SDA  (via drill 0.35)
  Top 0.15: U1.43 47.77,24.31 47.8,24.28 47.8,22.38 v47.94,22.24 | 22.74,23.13 v22.9,22.97 | LCD.Y36 28.34,27.73 24.28,27.73 22.79,26.24 22.79,23.08 v22.9,22.97 | v22.9,22.97 22.96,22.91 22.96,16.16 R36.P$2 | R14.P$2 52.63,54.01 52.59,54.06
  Top 0.152: P30.P$1 10.74,23.77 v10.74,24.23
  Top 0.2: v10.74,24.23 10.74,25.07 11.08,25.41 11.08,49.98 11.65,50.55 11.65,53.64 12.94,54.93 v12.82,55.04 | v48.82,55.95 50.42,55.95 Q5.2
  Top 0.254: U3.16 25.03,14.74 23.85,15.92 R36.P$2
  Top 0.5: Q5.2 51.62,55.74 52.59,54.78 52.59,54.06
  Bottom 0.15: v47.94,22.24 47.91,22.21 45.41,22.21 44.91,22.71 23.56,22.71 23.3,22.97 v22.9,22.97
  Bottom 0.2: v22.9,22.97 22.1,22.97 20.9,24.17 10.8,24.17 v10.74,24.23 | v12.82,55.04 13,55.22 48.09,55.22 v48.82,55.95
GPIO38-SDA-  (via drill 0.35)
  Top 0.154: P40.P$1 46.96,56.16 46.65,55.85
  Top 0.2: 38.92,57.57 R11.P$1 38.92,57.5 v39.26,57.16 | v46.32,56.69 46.43,56.69 46.96,56.16
  Top 0.254: J10.6 36.52,55.82 37.96,57.26 38.61,57.26 38.92,57.57
  Top 0.5: Q5.3 48.41,54.79 P40.P$1
  Bottom 0.2: v39.26,57.16 39.28,57.14 45.87,57.14 v46.32,56.69
GPIO39-SCL  (via drill 0.35)
  Top 0.15: U1.44 47.97,24.71 48.35,24.33 48.35,22.98 48.32,22.95 v48.32,22.92 | LCD.Y37 24.6,27.26 23.32,25.98 23.32,23.61 v23.3,23.59 23.44,23.45 23.44,19.29 | 23.44,19.29 23.44,17.25 23.78,16.91 | R35.P$1 24.66,19.29 23.8,19.29 | 23.8,19.29 23.44,19.29 | P31.P$1 23.75,18.93 23.75,19.24 23.8,19.29
  Top 0.2: 11.52,48.57 11.52,24.96 v11.56,24.92 | 11.52,48.57 11.55,48.6 | 11.52,48.57 11.52,49.86 12.12,50.46 12.12,53.28 v12.99,54.15 | v47.04,54.21 49.53,51.72 Q6.2
  Top 0.254: U3.15 25.45,15.24 23.78,16.91 23.75,16.94 23.75,18.79 | 23.75,18.79 23.75,18.93 | R35.P$1 24.16,18.79 23.75,18.79
  Top 0.5: Q6.2 52.44,51.72 R29.P$2
  Bottom 0.15: v48.32,22.92 48.3,22.92 48.2,22.82 45.41,22.82 45.17,23.06 24.23,23.06 23.92,23.37 23.5,23.79 v23.3,23.59
  Bottom 0.2: 23.92,23.37 23.25,23.37 23.12,23.5 22.49,23.5 21.07,24.92 v11.56,24.92 | v12.99,54.15 13.2,54.15 13.54,54.49 46.76,54.49 v47.04,54.21
GPIO39-SCL-  (via drill 0.35)
  Top 0.15: 47.24,52.38 P39.P$1
  Top 0.2: J10.5 36.02,53.39 v36.34,53.07 | P39.P$1 46.57,53.05 v46.57,53.17
  Top 0.254: P39.P$1 47.2,52.8 | J10.5 36.02,56.03 37.94,57.95 R12.P$1
  Top 0.5: Q6.3 47.24,52.18 47.24,52.38
  Bottom 0.2: v36.34,53.07 36.44,53.17 v46.57,53.17
GPIO42  (via drill 0.35)
  Top 0.15: R19.P$1 41.24,15.05 41.24,17.09 41.24,17.23 | U1.48 48.22,26.31 51.29,23.24 52.05,23.24 54.86,20.43 54.86,19.64 54.66,19.64 v54.6,19.7
  Top 0.152: 39.63,18.81 39.66,18.81
  Top 0.5: 39.66,18.81 41.24,17.23 | 41.24,17.2 41.24,17.09 41.31,17.02 R19.P$1
  Top 0.524: J1.1 39.63,18.81
  Bottom 0.15: v54.6,19.7 54.55,19.7 | 40.56,19.28 53.95,19.28 | 39.73,19.28 39.26,19.28
  Bottom 0.152: 39.16,19.28 J1.1 | 53.95,19.28 54.41,19.74 54.41,19.84 54.55,19.7
  Bottom 0.5: 39.73,19.28 40.56,19.28 40.13,19.28
  Bottom 0.524: 39.73,19.28 39.16,19.28
HSYNC  (via drill 0.35)
  Top 0.15: U1.21 37.08,27.11 34.07,30.12 33.45,30.12 33.23,30.12 32.75,30.6 30.68,30.6 v30.46,30.82 | LCD.Y15 28.41,38.22 v30.03,38.22 30.03,38.2 P12.P$1
  Top 0.152: 40.28,27.09 U1.21 40.27,27.14
  Bottom 0.15: v30.03,38.22 30.34,37.91 30.34,30.94 v30.46,30.82
IOVCC
  Top 0.15: LCD.Y40 31.16,25.76 R16.1 | P29.P$1 31.53,23.05 R17.1
  Top 0.28: R16.1 32.07,24.81 R17.1 | P29.P$1 31.15,22.66
LCD_CS  (via drill 0.35)
  Top 0.15: U1.22 37.02,26.71 34.71,29.01 | v30.23,40.05 v30.22,40.04 30.22,40.01 | 30.22,40.01 29.97,40.26 LCD.Y11 | P10.P$1 30.22,39.82 30.22,40.01
  Top 0.2: 34.71,29.01 32.8,29.01 v32.61,29.2
  Bottom 0.15: v32.61,29.2 32.44,29.37 32.44,33.61 30.73,35.32 30.73,39.42 30.23,39.92 v30.23,40.05
LCD_LEDA
  Top 0.15: LCD.Y1 28.26,45.37 | 21.65,47.37 P4.P$1 21.55,47.4 | R23.2 18.07,50.88
  Top 0.254: C25.2 16.35,51.4 | 18.32,51.23 18.15,51.4 R23.2
  Top 0.5: 28.26,45.37 23.65,45.37 21.65,47.37 | 21.55,47.4 18.07,50.88
  Top 1: R23.2 16.35,51.4
LCD_LEDK
  Top 0.15: 18.4,48.67 Q3.3
  Top 0.152: 18.4,48.49 18.4,48.14 P5.P$1 18.3,48.24 Q3.3
  Top 0.25: 19.54,47.01 P5.P$1 | LCD.Y2 22.13,44.76 | LCD.Y3 21.85,44.26
  Top 0.254: 19.24,47.1 P5.P$1 19.56,47.2 19.62,47.27
  Top 0.3: 22.13,44.76 19.62,47.27 18.4,48.49 18.4,47.71 21.85,44.26
LCD_RST  (via drill 0.35)
  Top 0.15: 28.96,18.85 29.65,18.15 | P7.P$1 29.59,19.18 v29.59,19.08 | v17.38,21.62 15.12,23.88 15.12,37.84 20.04,42.76 LCD.Y6
  Top 0.154: P7.P$1 29.12,18.38 | 29.09,18.38 29.09,18.26 | 29.65,18.38 29.65,18.15 | 29.15,18.29 29.15,18.22
  Top 0.254: U3.10 28.31,17.45 29.12,18.26 | 29.12,18.26 29.15,18.29 | 29.12,18.26 29.09,18.26 | 29.09,18.38 29.12,18.38 29.65,18.38
  Bottom 0.15: v29.59,19.08 21.93,19.08 | 17.84,21.17 v17.38,21.62
  Bottom 0.2: 17.84,21.17 18.67,21.17 19.06,20.77 20.2,20.77 20.24,20.77 21.93,19.08
LCD_SCK
  Top 0.15: 36.18,39.93 36.18,40
  Top 0.152: P9.P$1 36.18,39.93 | 36.18,40 36.08,40
  Top 0.2: U1.7 44,32.18 36.34,39.84 36.18,40 | 36.2,40 36.08,40 31.33,40 30.57,40.76 LCD.Y10
LCD_SDA
  Top 0.15: 39.48,38.78 P8.P$1 39.27,38.4 39.09,38.23
  Top 0.2: U1.6 44.4,32.92 39.09,38.23 36.99,40.33 31.63,40.33 30.7,41.26 LCD.Y9
LED-ON  (via drill 0.35)
  Top 0.152: R1.P$1 12.96,50.76 Q1.1
  Top 0.2: U3.8 30.01,16.64 30.01,17.6 v29.91,17.7 29.86,17.75 | R1.P$1 13.45,48.94 13.45,21.3 | 13.45,21.3 13.42,21.27 | v13.57,21.24 13.51,21.24 13.45,21.3
  Bottom 0.2: v29.91,17.7 23.33,17.7 22.52,18.51 21.71,18.51 20.15,20.07 17.44,20.07 16.27,21.24 v13.57,21.24
MISO  (via drill 0.35)
  Top 0.15: U1.34 43.2,21.3 43.04,21.14 v43,21.14 | v52.03,21.07 52.37,20.73 52.37,17.95 51.94,17.52 U$24.2
  Bottom 0.15: v52.03,21.07 52.03,21.26 52.02,21.27 43.13,21.27 v43,21.14
N$3
  Top 0.254: 21.83,56.27 L3.1
  Top 0.54: U2.3 21.83,56.27
N$4
  Top 0.15: R22.1 23.84,14.53 25.31,13.06 27.63,13.06 27.85,13.28 27.85,13.95 U3.2
N$5
  Top 0.2: R10.P$1 56.18,48.8 PWR.+
N$7
  Top 0.15: ANT.P$2 64.03,30.99
  Top 0.152: 51.23,30.98 R6.P$1
  Top 0.2: C2.2 52.34,30.99
  Top 0.5: C2.2 R6.P$1 | 64.03,30.99 52.34,30.99
N$8
  Top 0.152: 77.53,36.09 77.61,36.01
N$10  (via drill 0.35)
  Top 0.15: v37.92,25.41 v37.92,25.42 38.01,25.51 U1.25 | v42.37,36.35 42.37,37.16 R43.2
  Bottom 0.15: v37.92,25.41 38.53,26.02 38.53,30.41 40.87,32.75 40.93,32.81 42.38,34.26 v42.38,36.34 v42.37,36.35
N$11
  cutout Top: -1.43,30.12 -0.12,31.43 -0.12,32.59 -1.91,34.38 -5.04,34.38 -8.05,31.37 -8.92,31.37 -10.21,30.08 -10.72,30.08 -10.89,29.91 -11.68,29.91 -14.47,27.12 -14.65,27.12 -14.48,26.95
N$14
  Top 0.152: P47.P$1 22.37,48.95
  Top 0.254: R31.P$2 19.68,55.24 R40.P$1 19.68,54.59 19.01,53.92 19.01,50.69 19.92,49.78 22.49,49.78 | U2.5 23.83,50.56 23.05,49.78 22.49,49.78 | P47.P$1 22.37,49.66 22.49,49.78
N$16  (via drill 0.35)
  Top 0.15: 43.18,37.21 R44.2 43.5,37.11 v43.5,36.4 | U1.26 38.63,25.11 38.56,25.04 v38.56,25.01
  Bottom 0.15: v38.56,25.01 38.82,25.27 38.82,30.28 41.19,32.65 41.35,32.81 43.61,35.07 43.63,35.07 43.63,36.4 v43.5,36.4
N$17
  Top 0.254: U3.3 28.31,12.47 R34.1
N$18
  Top 0.254: U3.4 28.81,12.83 28.9,12.74 R37.1
N$19
  Top 0.15: 25.61,15.74 25.05,16.3 25.05,18.62 R18.2
  Top 0.254: U3.14 25.61,15.74
N$20  (via drill 0.35)
  Top 0.15: R24.P$2 33.46,38.11 v33.46,38.79 | 31.35,44.23 31.35,44.09 31.35,41.26 31.66,40.95 | v22.75,47.82 22.75,47.67 24.38,46.04 29.29,46.04 29.54,46.04 | v19.48,44.18 17.21,46.45 15.69,46.45 14.98,47.16 14.98,48.79 15.81,49.62 Q3.1
  Top 0.152: 33.14,40.95 33.44,40.95 v33.47,40.98
  Top 0.2: 33.51,41.06 33.38,40.93 33.36,40.95 33.14,40.95 31.66,40.95 | 29.29,46.04 30.43,46.04 R2.P$2 30.98,45.79 31.34,45.43 31.34,44.1 31.35,44.09
  Bottom 0.15: v33.46,38.79 33.46,40.56 | v33.46,40.97 v33.47,40.98 | v22.75,47.82 22.75,47.45 v19.48,44.18
  Bottom 0.152: 33.46,40.56 v33.46,40.97
N$117
  Top 0.15: U1.30 41.6,22.85 40.66,21.91 40.66,19.45 42.59,17.52 U$24.7
N$198
  Top 0.15: U1.1 46.4,30.87
  Top 0.2: C4.2 48.92,30.87 46.4,30.87
  Top 0.5: R6.P$2 C4.2
N$199
  Top 0.15: U1.33 42.8,22.14 42.42,21.76 42.42,19.52 43.16,18.79 U$24.6
N$200
  Top 0.15: U1.35 43.6,20.2 U$24.5
N$201
  Top 0.15: U1.53 49.88,28.31 50.62,27.57 51.81,27.57 52.92,26.47 Y1.3 53.26,26.22 C13.1
  Top 0.152: U1.53
N$202
  Top 0.15: U1.54 51.09,28.71 Y1.1 52.22,27.71 54.37,27.71 C9.1
  Top 0.152: 50.62,28.77 Y1.1
PCLK  (via drill 0.35)
  Top 0.15: 48.18,25.92 51.27,22.83 51.92,22.83 | P11.P$1 16.6,24.13
  Top 0.152: P11.P$1 16.29,24.44
  Top 0.2: 48.18,25.92 U1.47 | v54.13,20.31 54.17,20.35 54.17,20.57 51.92,22.83 | P11.P$1 16.12,24.61 16.12,37.68 18.2,39.76 LCD.Y12 | v19.12,21.75 16.6,24.27 16.6,24.13
  Bottom 0.2: v54.13,20.31 53.51,19.69 41.36,19.69 39.67,21.38 33.04,21.38 33.05,21.38 19.58,21.38 19.21,21.75 v19.12,21.75
R1  (via drill 0.35)
  Top 0.15: U1.52 48.25,27.91 51.51,24.65 52.43,24.65 56.32,20.76 56.32,17.29 v55.47,16.44 | v20.5,18.19 20.73,18.42 P24.P$1 | LCD.Y29 24.8,31.26 21.76,28.23 21.76,22 20.22,20.46 20.22,19.09 20.65,18.66 20.65,18.41
  Top 0.152: 21.28,18.02 P24.P$1 20.73,18.41 20.65,18.41
  Bottom 0.15: v55.47,16.44 53.83,14.8 21.42,14.8 18.77,17.45 18.77,17.87 19.09,18.19 v20.5,18.19
R2  (via drill 0.35)
  Top 0.15: v37.16,38.15 37.52,38.15 43.6,32.07 U1.8 | 30.96,31.38 31.37,30.97 31.37,30.96 32.88,30.96 | 33.14,30.83 33.01,30.96 32.88,30.96 | P17.P$1 32.89,30.97 32.88,30.96
  Top 0.2: LCD.Y30 29.44,30.76 30.06,31.38 30.96,31.38 | v33.64,30.7 33.27,30.7 33.14,30.83
  Bottom 0.15: v37.16,38.15 36.28,38.15 35.09,36.96 35.09,34.56 33.96,33.43 33.96,31.02 v33.64,30.7
R3  (via drill 0.35)
  Top 0.15: LCD.Y31 32.46,30.26 33.1,29.62 v33.66,29.62 | U1.13 41.6,31.1 41.14,31.56 39.2,31.56 P26.P$1 39.16,34.09 37.73,35.52 v35.84,35.52
  Top 0.154: P26.P$1
  Bottom 0.15: v35.84,35.52 35.84,34.77 34.26,33.19 34.26,30.46 33.66,29.86 v33.66,29.62
R4  (via drill 0.35)
  Top 0.12: 28.43,29.7 LCD.Y32
  Top 0.15: LCD.Y32 31.3,29.76 31.57,29.49 | v31.71,29.19 31.71,29.35 31.57,29.49 | v32.06,28.09 v32.07,28.1 34.79,28.1 36.98,25.91 U1.24 | P27.P$1 31.57,29.49
  Top 0.154: 31.65,29.28 P27.P$1
  Bottom 0.15: v31.71,29.19 31.71,28.44 v32.06,28.09
R5
  Top 0.15: 30.5,29.07 30.94,28.63 34.65,28.63 36.97,26.31 39.46,26.31 | 30.5,29.07 30.31,29.26 LCD.Y33 | P28.P$1 30.32,28.89 30.5,29.07
  Top 0.152: 39.46,26.31 U1.23
RESET  (via drill 0.35)
  Top 0.15: J10.9 38.02,55.48 v38.48,55.94 38.81,56.27 40.72,56.27 41.96,57.51 R50.P$2 C5.2 42.99,57.72 | P43.P$1 45.2,50.31 U1.4
  Top 0.254: P43.P$1 45.9,55.82 v45.67,56.05
  Bottom 0.254: v45.67,56.05 41.3,56.05 41.19,55.94 v38.48,55.94
SPICS0  (via drill 0.35)
  Top 0.15: U1.32 42.4,22.67 42.38,22.67 41.68,21.97 41.68,21.75 v41.81,21.62 | v52.9,20.99 52.9,17.05 52.09,16.25 U$24.1
  Bottom 0.15: v41.81,21.62 41.87,21.68 52.32,21.68 52.9,21.1 v52.9,20.99
SPIWP  (via drill 0.35)
  Top 0.15: U1.31 42,22.84 41.03,21.87 41.03,19.76 42.1,18.69 42.13,18.69 v42.18,18.64 | R27.P$2 45.15,14.07 45.62,14.54 45.62,17.63 45.52,17.73 45.52,18.59 v45.47,18.64 | v49.43,18.61 49.61,18.79 U$24.3
  Bottom 0.15: v42.18,18.64 45.27,18.64 | 45.31,18.6 45.27,18.64 | 45.27,18.64 v45.47,18.64 49.4,18.64 v49.43,18.61
TP_INT  (via drill 0.35)
  Top 0.15: LCD.Y35 24.21,28.26 22.37,26.42 22.37,20.94 22.33,20.98 22.33,20.99 | v29.45,19.93 30.44,18.94 30.44,15.85 30.35,15.76
  Top 0.2: 22.17,21.14 22.33,20.99 | 22.17,21.14 P25.P$1 22.33,20.98 v22.33,20.75 | R3.1 21.34,20.31 22.17,21.14
  Top 0.254: U3.7 30.33,15.74 30.35,15.76
  Bottom 0.15: v22.33,20.75 22.78,20.3 29.08,20.3 v29.45,19.93
TP_RST  (via drill 0.35)
  Top 0.15: R13.P$2 30.63,13.66 | 30.63,13.66 30.63,13.72 U3.5 | v24.03,20.82 23.8,21.05 23.8,23.8 23.75,23.85 23.75,25.82 24.69,26.76 LCD.Y38 | v29.56,20.78 30.4,19.94 P32.P$1 | 30.63,13.66 30.88,13.91 30.88,14.77 30.88,19.28 30.19,19.97 30.21,19.99
  Top 0.152: 30.19,19.97 30.19,20.53 P32.P$1
  Top 0.254: U3.5 30.85,14.74 30.88,14.77
  Top 0.3: 30.51,20.85 P32.P$1
  Bottom 0.15: v24.03,20.82 29.52,20.82 v29.56,20.78
UART0_RXD0-  (via drill 0.35)
  Top 0.2: J10.3 35.02,53.29 33.92,52.19 v33.92,48.86 33.78,48.72 P33.P$1 | v12.87,48.58 12.87,20.57 v13.28,20.16
  Top 0.25: J10.3 35.02,56.41 35.96,57.35 R9.P$1
  Top 0.254: Q9.3 v35.72,13.28 35.7,13.29
  Bottom 0.2: v33.92,48.86 13.15,48.86 v12.87,48.58 | v13.28,20.16 20.08,13.36 35.25,13.36 35.59,13.02 35.72,13.15 v35.72,13.28
UART0_TXD0-  (via drill 0.35)
  Top 0.152: P38.P$1 12.14,21.56
  Top 0.154: P38.P$1 11.79,21.56
  Top 0.2: Q8.3 v31.93,12.77 | v12.14,20.77 12.14,21.56 v12.14,48.99 12.01,49.12 | v34.71,49.55 34.71,52.2 35.52,53.01 35.52,54.71
  Top 0.254: J10.4 35.52,54.71 35.52,56.24 36.95,57.67 R5.P$1
  Bottom 0.2: v31.93,12.77 19.51,12.77 12.14,20.14 v12.14,20.77 | v12.14,48.99 12.7,49.55 v34.71,49.55
USB-D+
  Top 0.15: R44.1 43.54,39.52 P42.P$1 43.72,45.64 37.52,51.84 J10.8
USB-D-
  Top 0.15: R43.1 42.34,39.25 41.85,39.74 | J10.7 37.02,52.54 36.98,52.5 36.98,51.86 43.29,45.55 43.29,41.52 42.27,40.5 42.27,39.74
  Top 0.154: 41.85,39.74 P37.P$1 42.27,39.74
VCC_5V
  Top 0.254: 27,53.36 C17.2 | C17.2 | C20.2 29.18,53.13 | C16.1 25.53,52.9 25.53,53.36 | 20.54,50.82 C18.2 | U2.4 22.25,50.82 | 25.11,52.8 C16.1 | C16.1 25.76,53.13 C17.2 | C15.1 39.11,58.88 R11.P$2 R12.P$2 R5.P$2 36.93,58.88 R9.P$2 35.76,58.88 C19.1 34.27,57.39 | 33.9,54.71 J10.1 J10.2 34.27,54.84 | 29.97,54.71 P46.P$1
  Top 0.54: U2.4 20.54,50.82 | 22.25,50.82 23.36,51.93 24.24,51.93 25.11,52.8 | 34.27,57.39 34.27,54.84
  Top 0.6: U2.1 25.53,53.36
  Top 0.8: C17.2 29.18,53.13 29.18,53.92 P46.P$1 | 25.53,53.36 27,53.36 | 33.9,54.71 29.97,54.71
VDD_3.3V  (via drill 0.35)
  Top 0.15: 40.29,14.13 R20.P$2 38.33,14.13 37.91,14.54 37.66,14.8 Q9.1 37.64,15.71 R38.P$2 | 40.29,14.13 41.26,14.13 | 32.76,25.49 32.73,25.52 | 34,16.33 34.08,16.25 34.08,14.93 Q8.1 34.44,14.45 34.44,13.88 34.51,13.81 | 22.37,15.22 22.37,15.12 22.37,14 22.3,14 22.3,14.25 | 22.3,14.25 22.3,14.43 R22.2 | 24.01,15.22 23.82,15.22 22.37,15.22 | 22.37,15.22 22.3,15.22 R36.P$1 22.23,15.99 | R18.1 26.83,20.4 R21.P$2 | R13.P$1 31,11.28 | 22.32,14.23 22.3,14.25 | 24.88,20.41 24.9,20.41 24.91,20.4 | 40.29,12.27 40.29,13.51 40.29,13.83 40.29,14.05 40.29,14.13 | 20.13,15.99 C7.1 19.96,16.19 | 19.69,60.39 19.66,60.42 | 14.16,51.14 14.25,51.05 | 15.3,56.03 15.27,56.03 | 41.44,60.48 41.38,60.42 | 41.38,60.42 41.34,60.38 | 41.38,60.42 41.96,59.84 R50.P$1 | 53.77,52.85 53.77,52.6 | 53.77,52.6 53.77,52.15 R29.P$1 53.47,50.04 53.35,49.92 50.79,49.92 Q6.1 | R14.P$1 53.63,53.95 53.78,53.8 | 53.77,52.6 53.78,52.59 | 53.77,54.19 R14.P$1 | 51.02,47.59 50.7,47.59 50.62,47.59 C8.1 50.52,47.58 L2.1
  Top 0.152: 39.06,14.18 R20.P$2 | R40.P$2 19.51,56.29 | C3.2 48.73,29.13 48.63,29.13 | 40.59,60.48 40.73,60.62 | 44.09,60.62 v44.09,60.35 | 14.07,52.92 14.16,52.83 | R1.P$2 14.14,49.43 14.16,49.41
  Top 0.154: C22.1 32.06,56.74 | 22.3,14.66 R22.2
  Top 0.2: U1.46 48.11,25.51 49.67,23.95 49.67,22.61 | 49.67,22.61 49.67,22.15 | v40.76,13.44 40.36,13.44 40.29,13.51 | R10.P$2 53.93,49.68 53.77,49.84 | 48.91,29.51 U1.56 | 48.91,29.51 49.42,30.02 54.2,30.02 54.93,29.29 | 48.91,29.51 48.53,29.13 48.63,29.13 49.13,29.13 49.11,29.11 U1.55 | 54.93,29.29 56.51,27.71 56.51,27.4 | v50.65,22.51 50.63,22.49 | 49.79,22.49 49.77,22.51 49.67,22.61 | C22.1 31.58,56.66 C36.2 | C14.1 54.93,29.29 | R50.P$1 41.96,60.25 42.09,60.38 | C23.1 49.89,22.51 49.64,22.51 | R3.2 22.28,19.25 22.3,19.23 | R35.P$2 25.78,20.35 R18.1
  Top 0.254: L3.2 26.54,56.44 | L3.2 26.97,57.01 | C36.2 30.14,56.6 | 31.78,56.94 C22.1 31.77,56.85 | R14.P$1 53.42,53.84 | R16.2 32.97,24.71 | L3.2 26.64,56.68 | R23.1 18.39,52.61 | 18.07,54.49 C6.1 17.99,54.64 | 19.47,56.12 R40.P$2 | 32.27,60.38 32.27,60.39 | R16.2 33.74,24.83 34.27,24.3 34.27,22.71 31.93,20.37 31.95,20.37 31.95,18.62 33.25,17.32 33.36,17.32 34.08,16.6 34.08,14.93 | 24.1,15.13 25.24,13.99 U3.1 | 24.1,15.13 24.01,15.22 | 22.3,15.12 22.37,15.12 22.88,15.12 22.9,15.13 23.73,15.13 | 23.82,15.22 23.73,15.13 | 23.73,15.13 24.1,15.13 | R36.P$1 22.3,19.23 22.3,19.53 v22.34,19.57 v22.34,19.58 | v23.97,19.79 24.53,20.35 R35.P$2 24.88,20.41 | R16.2 32.9,25.02 32.9,25.35 32.76,25.49 32.75,25.49 32.04,26.2 | LCD.Y39 31.98,26.26 32.04,26.2 | 32.73,25.52 32.78,25.52 33.28,25.02 | 32.04,26.2 C230.2
  Top 0.28: 33.32,25.02 33.28,25.02 R16.2
  Top 0.3: 14.15,43.26 14.14,43.27 14.14,48.36 | 14.25,51.05 14.25,51.31
  Top 0.5: C22.1 31.95,56.85 | 34,16.33 R39.P$1 | R22.2 22.3,15.12 R36.P$1 | 22.23,15.99 20.13,15.99 | 19.51,56.29 19.51,60.02 | 19.96,16.19 14.14,22.01 14.14,48.36 14.16,48.38 14.16,49.41 14.16,51.14 14.16,52.83 14.16,54.92 15.27,56.03 19.66,60.42 | 22.28,60.39 19.69,60.39 | C6.1 16.75,54.57 15.3,56.03 | 32.17,60.48 40.59,60.48 41.44,60.48 42,60.48 | 53.78,53.8 v53.78,53.41 53.78,52.59 | 41.34,60.38 42.09,60.38 | 53.77,49.84 53.77,52.85 51.88,52.85 50.89,53.84 Q5.1 | 53.77,49.84 53.77,49.56 51.8,47.59 50.7,47.59 | L2.1 50.52,47.49 50.62,47.59 | Q6.1 50.71,49.84 53.77,49.84 | 50.63,22.49 49.79,22.49 | 34.36,11.5 34.36,10.55 33.53,9.72 30.68,9.72 | 34.36,11.5 34.36,14.53 Q8.1 | 30.68,9.72 25.14,9.72 22.3,12.56 22.3,14.43 | R13.P$1 30.63,9.77 30.68,9.72 | 34.36,11.5 37.14,11.5 37.16,11.48 38.18,12.5 38.18,14.28 | 37.91,14.54 38.18,14.28 | R38.P$2 37.1,16.25 37.1,14.99 37.29,14.8 37.66,14.8 | 38.18,14.28 38.41,14.05 39.91,14.05 | 39.91,14.05 40.29,14.05 | 41.26,14.13 R19.P$2 40.76,14.08 | v46.96,14.17 46.83,14.3 46.83,19.51 47.57,20.25 47.57,20.44 49.64,22.51 49.77,22.51 | C14.1 54.85,29.26 56.28,27.83 56.28,27.17 | 56.51,27.4 56.28,27.17 | 56.28,27.17 56.28,23.66 v56.34,23.6 | v43.19,60.35 43.06,60.48 42,60.48 | v53.54,54.8 53.63,54.71 53.63,53.95 | P6.P$1 42,60.48 | 39.91,14.05 39.94,14.08 40.76,14.08 | 40.76,14.08 v40.76,13.44 | C21.1 40.29,12.27 40.29,13.83
  Top 0.524: 40.73,60.62 44.09,60.62 | Q1.2 14.07,52.92
  Top 0.54: 18.07,54.49 R23.1
  Top 1: 26.64,56.68 C12.2 30.19,56.68 C36.2 32.6,56.66 32.9,56.96 32.9,59.75 32.27,60.38 32.17,60.48 | 32.27,60.39 22.28,60.39 19.88,60.39 19.51,60.02
  Bottom 0.2: 40.87,13.55 v40.76,13.44
  Bottom 0.254: v22.34,19.58 22.49,19.73 24.16,19.73 24.1,19.79 v23.97,19.79
  Bottom 0.5: v50.65,22.51 55.25,22.51 v56.34,23.6 | v43.19,60.35 v44.09,60.35 47.7,60.35 52.92,55.13 53.25,54.8 v53.54,54.8 | v46.96,14.17 46.34,13.55 40.87,13.55
  Bottom 0.524: 52.92,55.13 54.14,53.91 54.14,53.41 v53.78,53.41
VDD_LCD  (via drill 0.35)
  Top 0.152: LCD.Y5 30.34,43.26 C10.1 | 17.37,43.37 v15.63,45.1 | 10.21,50.02 C11.1 | P34.P$1 10.03,46.33 10.37,46.33
  Top 0.3: Q1.3 10.72,50.53 10.21,50.02 | C11.1 10.37,49.84 10.37,46.33 v10.37,45.09 | LCD.Y5 17.47,43.26 | 17.47,43.26 17.37,43.37 | 17.47,43.26 17.44,43.26 15.58,45.12
  Bottom 0.152: v15.62,45.09 v15.63,45.1
  Bottom 0.3: v10.37,45.09 v15.62,45.09
VDD_SPI
  Top 0.15: U$24.8 43.67,16.18 43.67,15.05 R27.P$1 C1.1 42.41,17.04 40.3,19.15 40.3,22.03 41.2,22.93 U1.29
VSYNC
  Top 0.15: U1.12 42.03,30.44 42.03,31.66 40.91,32.78 | 40.91,32.78 37.59,36.1 34.27,36.1 31.61,38.76 LCD.Y14 | P3.P$1 40.88,32.78 40.91,32.78
  Top 0.152: 40.59,32.64 P3.P$1

## Text on the board
tPlace: U3 | ESP32 Display 2.1-Main | V1.0